# EAGLE schematic BCD_Counter_1.1 (EAGLE 7.6.0)
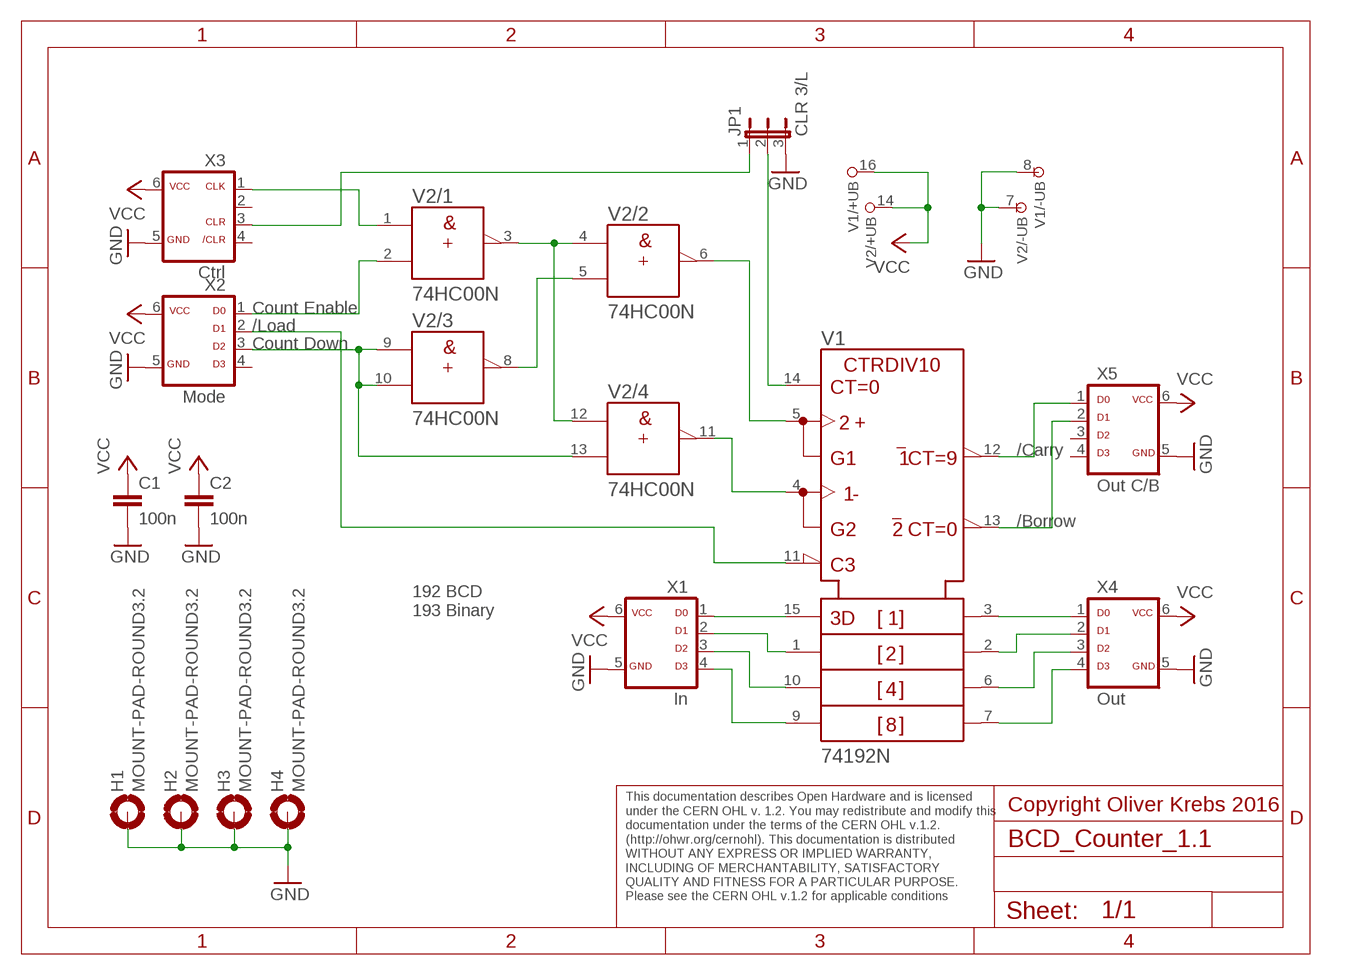
[diagram p0: schematic, sheet 1]

## Parts
C1  100n  C-EU050-025X075  [C050-025X075]
C2  100n  C-EU050-025X075  [C050-025X075]
H1  MOUNT-PAD-ROUND3.2  [3,2-PAD]
H2  MOUNT-PAD-ROUND3.2  [3,2-PAD]
H3  MOUNT-PAD-ROUND3.2  [3,2-PAD]
H4  MOUNT-PAD-ROUND3.2  [3,2-PAD]
JP1  CLR 3/L  JP2E  [JP2]
V1  74192N  [DIL16]
V2  74HC00N  [DIL14]
X1  In  ML6D  [ML-6]
X2  Mode  ML6D  [ML-6]
X3  Ctrl  ML6C  [ML-6]
X4  Out  ML6D  [ML-6]
X5  Out C/B  ML6D  [ML-6]

## Nets
GND: C1.2 C2.2 H1.B3,2(MOUNT) H2.B3,2(MOUNT) H3.B3,2(MOUNT) H4.B3,2(MOUNT) JP1.3 V1.8(-UB) V2.7(/-UB:-UB) X1.5 X2.5 X3.5 X4.5 X5.5
N$1: V1.15(A) X1.1
N$2: V1.1(B) X1.2
N$3: V1.10(C) X1.3
N$4: V1.9(D) X1.4
N$5: V1.3(QA) X4.1
N$6: V1.2(QB) X4.2
N$7: V1.6(QC) X4.3
N$8: V1.7(QD) X4.4
N$9: V1.13(!BO) X5.2
N$10: V1.12(!CO) X5.1
N$11: V2.1(/1:A) X3.1
N$12: V2.5(/2:B) V2.8(/3:Y)
N$13: V2.3(/1:Y) V2.4(/2:A) V2.12(/4:A)
N$14: V1.5(UP) V2.6(/2:Y)
N$15: V1.4(DOWN) V2.11(/4:Y)
N$16: JP1.2 V1.14(CLR)
N$17: V2.9(/3:A) V2.10(/3:B) V2.13(/4:B) X2.3
N$18: V2.2(/1:B) X2.1
N$19: V1.11(!LOAD) X2.2
N$20: JP1.1 X3.3
VCC: C1.1 C2.1 V1.16(+UB) V2.14(/+UB:+UB) X1.6 X2.6 X3.6 X4.6 X5.6
Unconnected: X2.4 X3.2 X3.4 X5.3 X5.4

## Notes on the sheet
- Count Enable
- /Load
- Count Down
- /Carry
- /Borrow
- 192 BCD
  193 Binary
- Copyright Oliver Krebs 2016
- This documentation describes Open Hardware and is licensed 
  under the CERN OHL v. 1.2. You may redistribute and modify this 
  documentation under the terms of the CERN OHL v.1.2. 
  (http://ohwr.org/cernohl). This documentation is distributed
  WITHOUT ANY EXPRESS OR IMPLIED WARRANTY, 
  INCLUDING OF MERCHANTABILITY, SATISFACTORY 
  QUALITY AND FITNESS FOR A PARTICULAR PURPOSE. 
  Please see the CERN OHL v.1.2 for applicable conditions

## Library data of the parts
C1 C2 = 01-my_rcl:C-EU: CAPACITOR, European symbol
H1-H4 = holes:MOUNT-PAD-ROUND: MOUNTING PAD, round
JP1 = jumper:JP2E: JUMPER
V1 = 74ttl-din:74*192: Synchronous 4-bit up down COUNTER
V2 = 74ttl-din:74*00: Quad 2-input NAND gate
X1 X2 X4 X5 = 01-my-con:ML6D
X3 = 01-my-con:ML6C